# EAGLE design ThermostatAVT1742 (EAGLE 9.6.2)
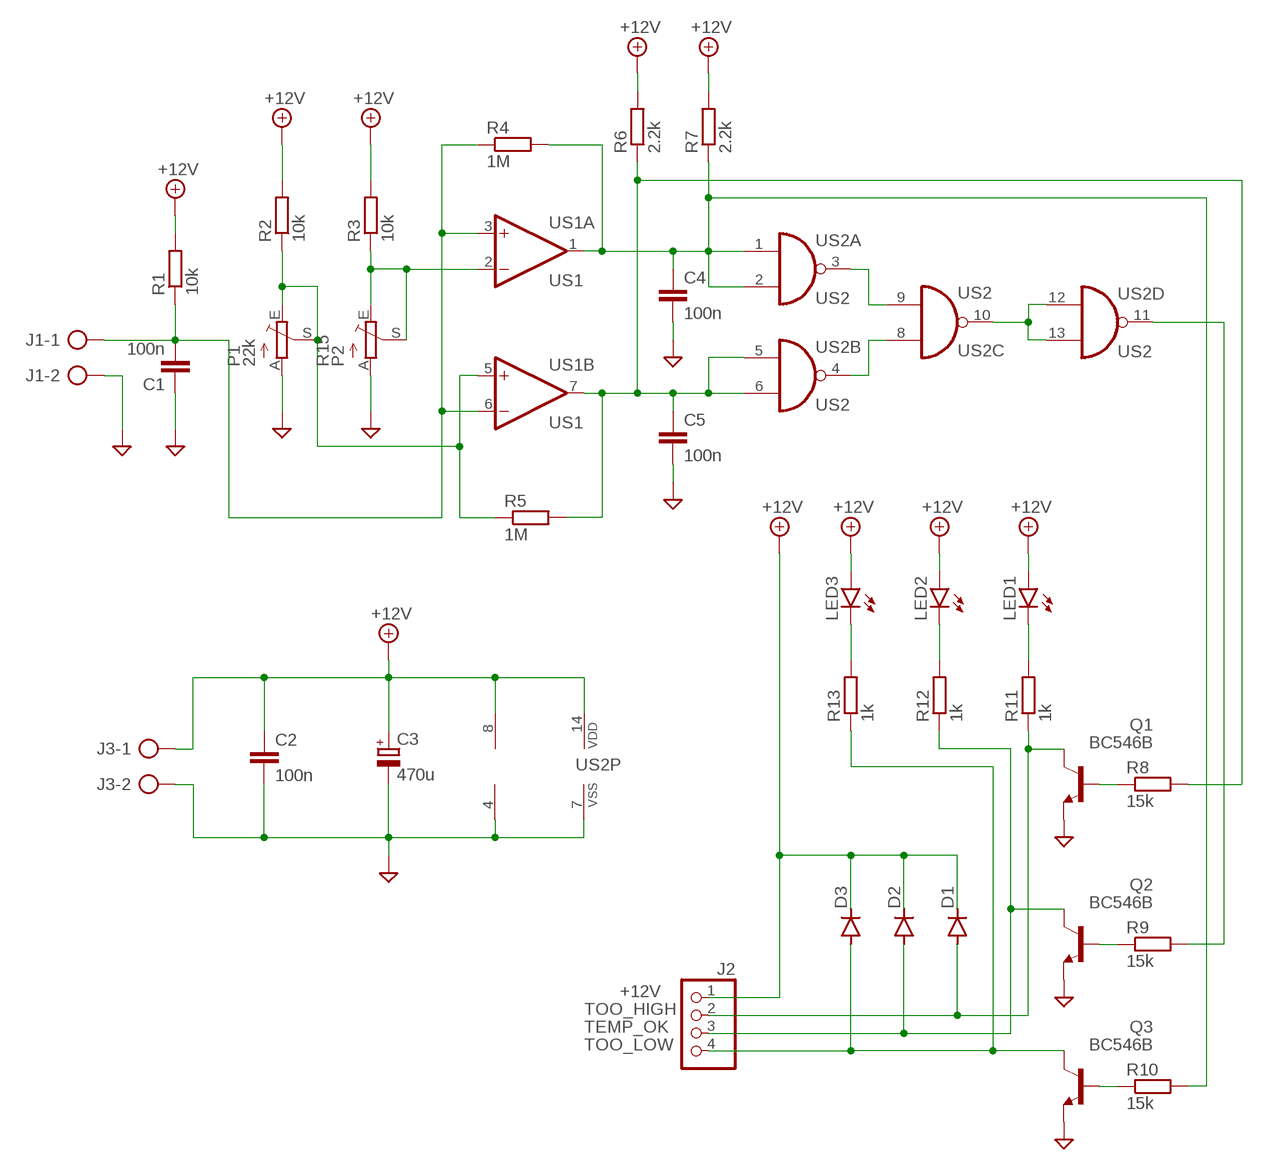
[diagram p0: schematic, sheet 1]

## Parts
C1  100n  C-EU050-025X075  [C050-025X075]
C2  100n  C-EU050-025X075  [C050-025X075]
C3  470u  CPOL-EUE3.5-8  [E3,5-8]
C4  100n  C-EU050-025X075  [C050-025X075]
C5  100n  C-EU050-025X075  [C050-025X075]
D1  red  1N4148DO35-10  [DO35-10]
D2  green  1N4148DO35-10  [DO35-10]
D3  yellow  1N4148DO35-10  [DO35-10]
J1  J1  AK500/2  [AK500/2]
J2  J2  PINHD-1X4  [1X04]
J3  J3  AK500/2  [AK500/2]
LED1  red  LED5MM  [LED5MM]
LED2  green  LED5MM  [LED5MM]
LED3  yellow  LED5MM  [LED5MM]
P1  22k  TRIM_EU-CA6V  [CA6V]
Q1  BC546B  [TO92-EBC]
Q2  BC546B  [TO92-EBC]
Q3  BC546B  [TO92-EBC]
R1  10k  R-EU_0207/10  [0207/10]
R2  10k  R-EU_0207/10  [0207/10]
R3  10k  R-EU_0207/10  [0207/10]
R4  1M  R-EU_0207/10  [0207/10]
R5  1M  R-EU_0207/10  [0207/10]
R6  2.2k  R-EU_0207/10  [0207/10]
R7  2.2k  R-EU_0207/10  [0207/10]
R8  15k  R-EU_0207/10  [0207/10]
R9  15k  R-EU_0207/10  [0207/10]
R10  15k  R-EU_0207/10  [0207/10]
R11  1k  R-EU_0207/10  [0207/10]
R12  1k  R-EU_0207/10  [0207/10]
R13  1k  R-EU_0207/10  [0207/10]
R15  P2  TRIM_EU-CA6V  [CA6V]
US1  US1  LM393N  [DIL08]
US2  US2  4011N  [DIL14]

## Nets
+12V: C2.1 C3.+ D1.C D2.C D3.C J2.1 J3.1 LED1.A LED2.A LED3.A R1.2 R2.2 R3.2 R6.2 R7.2 US1.8(P:V+) US2.14(P:VDD)
BASE_HIGH: Q1.B R8.1
BASE_LOW: Q3.B R10.1
BASE_OK: Q2.B R9.1
GND: C1.1 C2.2 C3.- C4.2 C5.2 J1.2 J3.2 P1.A Q1.E Q2.E Q3.E R15.A US1.4(P:V-) US2.7(P:VSS)
L_GREEN: LED2.K(C) R12.2
L_RED: LED1.K(C) R11.2
L_YELLOW: LED3.K(C) R13.2
NTC_SIGNAL: C1.2 J1.1 R1.1 R4.1 US1.3(A:+IN) US1.6(B:-IN)
OUT_HI_LOGIC: C4.1 R4.2 R7.1 R10.2 US1.1(A:OUT) US2.1(A:I0) US2.2(A:I1)
OUT_LO_LOGIC: C5.1 R5.2 R6.1 R8.2 US1.7(B:OUT) US2.5(B:I0) US2.6(B:I1)
PRESET_HIGH: R3.1 R15.E R15.S US1.2(A:-IN)
PRESET_LOW: P1.E P1.S R2.1 R5.1 US1.5(B:+IN)
SYGNAL_A: US2.3(A:O) US2.9(C:I1)
SYGNAL_B: US2.4(B:O) US2.8(C:I0)
TEMP_OK: D2.A J2.3 Q2.C R12.1
TEMP_OK_FINAL: R9.2 US2.11(D:O)
TEMP_OK_NEG: US2.10(C:O) US2.12(D:I0) US2.13(D:I1)
TOO_HIGH: D1.A J2.2 Q1.C R11.1
TOO_LOW: D3.A J2.4 Q3.C R13.1

## Library data of the parts
C1 C2 C4 C5 = rcl:C-EU: CAPACITOR, European symbol; SPICEPREFIX: C
C3 = rcl:CPOL-EU: POLARIZED CAPACITOR, European symbol; SPICEPREFIX: C
D1-D3 = diode:1N4148: DIODE high speed (Philips)
J1 J3 = con-ptr500:AK500/2: CONNECTOR; OC_FARNELL: unknown; OC_NEWARK: unknown
J2 = pinhead:PINHD-1X4: PIN HEADER
LED1-LED3 = led:LED: LED OSRAM: - CHIPLED LG R971, LG N971, LY N971, LG Q971, LY Q971, LO R971, LY R971 LH N974, LH R974 LS Q976, LO Q976, LY Q976 LO Q996 - Hyper CHIPLED LW Q18S LB Q993, LB Q99A, LB R99A - SideLED LS A670, LO A670, LY A670, LG A670, LP A670 LB A673, LV A673, LT A673, LW A673 LH A674 LY A675 LS A676, LA A676, LO A676, LY A676, LW A676 LS A679, LY A679, LG A679 - Hyper Micro SIDELED® LS Y876, LA Y876, LO Y876, LY Y876 LT Y87S - SmartLED LW L88C, LW L88S LB L89C, LB L89S, LG L890 LS L89K, LO L89K, LY L89K LS L896, LA L896, LO L896, LY L896 - TOPLED LS T670, LO T670, LY T670, LG T670, LP T670 LSG T670, LSP T670, LSY T670, LOP T670, LYG T670 LG T671, LOG T671, LSG T671 LB T673, LV T673, LT T673, LW T673 LH T674 LS T676, LA T676, LO T676, LY T676, LB T676, LH T676, LSB T676, LW T676 LB T67C, LV T67C, LT T67C, LS T67K, LO T67K, LY T67K, LW E67C LS E67B, LA E67B, LO E67B, LY E67B, LB E67C, LV E67C, LT E67C LW T67C LS T679, LY T679, LG T679 LS T770, LO T770, LY T770, LG T770, LP T770 LB T773, LV T773, LT T773, LW T773 LH T774 LS E675, LA E675, LY E675, LS T675 LS T776, LA T776, LO T776, LY T776, LB T776 LHGB T686 LT T68C, LB T68C - Hyper Mini TOPLED® LB M676 - Mini TOPLED Santana® LG M470 LS M47K, LO M47K, LY M47K Source: http://www.osram.convergy.de LUXEON: - LUMILED® LXK2-PW12-R00, LXK2-PW12-S00, LXK2-PW14-U00, LXK2-PW14-V00 LXK2-PM12-R00, LXK2-PM12-S00, LXK2-PM14-U00 LXK2-PE12-Q00, LXK2-PE12-R00, LXK2-PE12-S00, LXK2-PE14-T00, LXK2-PE14-U00 LXK2-PB12-K00, LXK2-PB12-L00, LXK2-PB12-M00, LXK2-PB14-N00, LXK2-PB14-P00, LXK2-PB14-Q00 LXK2-PR12-L00, LXK2-PR12-M00, LXK2-PR14-Q00, LXK2-PR14-R00 LXK2-PD12-Q00, LXK2-PD12-R00, LXK2-PD12-S00 LXK2-PH12-R00, LXK2-PH12-S00 LXK2-PL12-P00, LXK2-PL12-Q00, LXK2-PL12-R00 Source: www.luxeon.com KINGBRIGHT: KA-3528ASYC Source: www.kingbright.com
P1 R15 = pot:TRIM_EU-: POTENTIOMETER
Q1-Q3 = transistor-npn:BC546*: NPN Transistor
R1-R13 = rcl:R-EU_: RESISTOR, European symbol; SPICEPREFIX: R
US1 = linear:LM393: COMPARATOR
US2 = 40xx:4011: Quad 2-input NAND

## Board
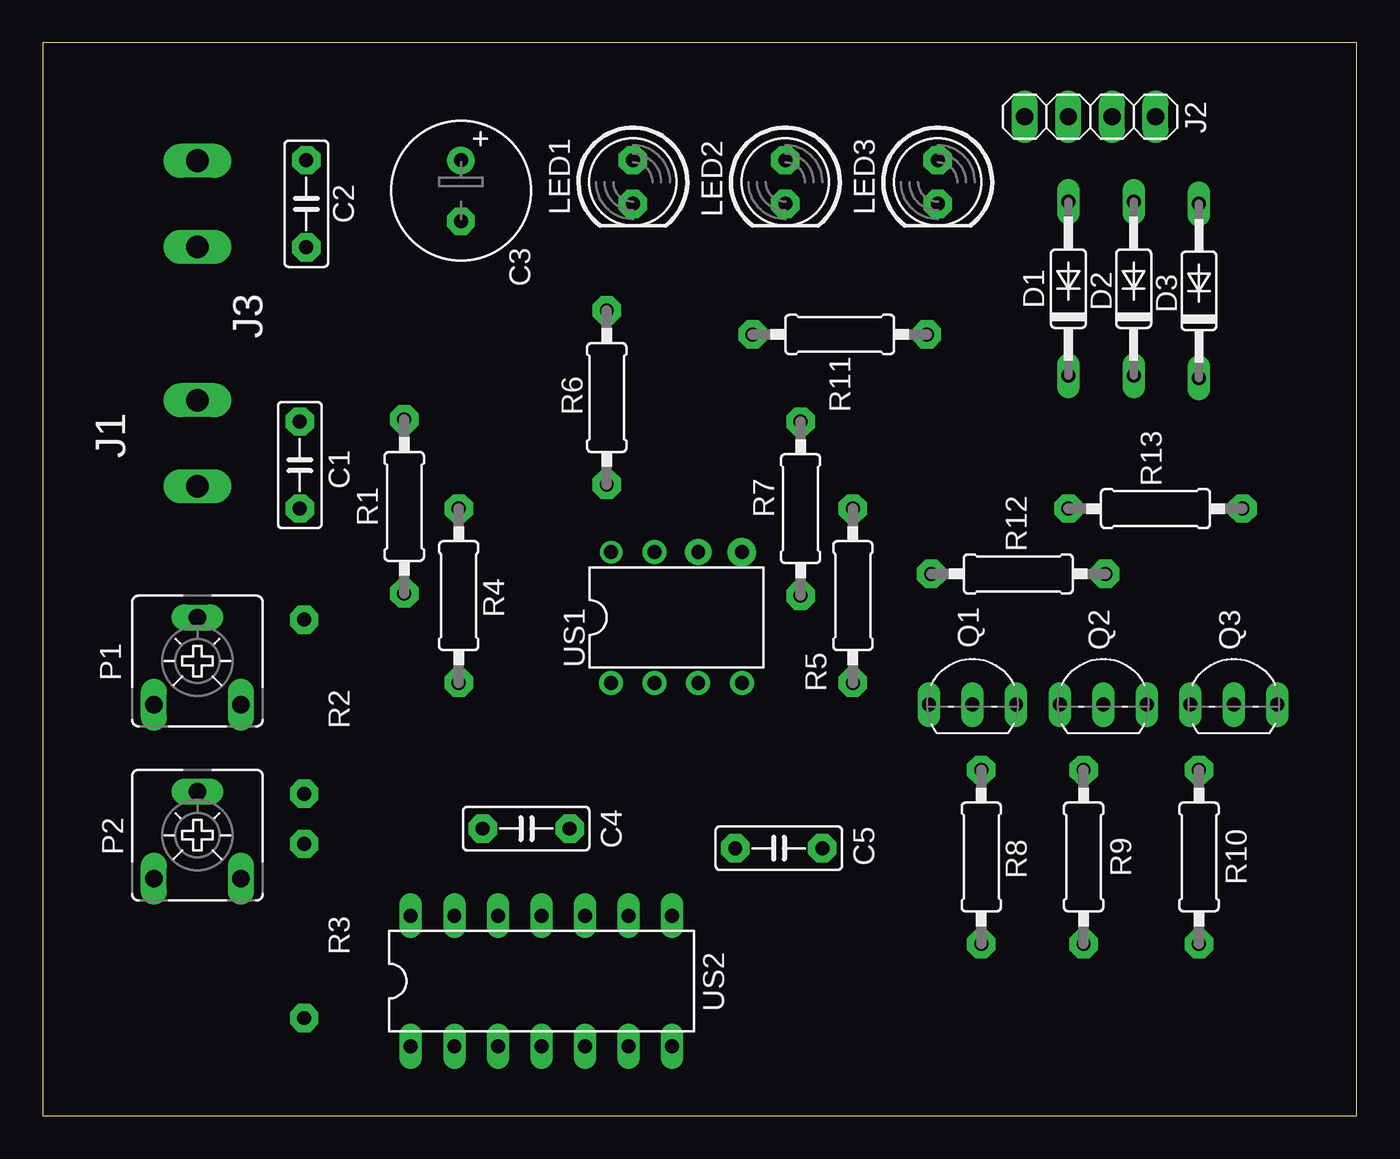
[diagram p1: board, top side]
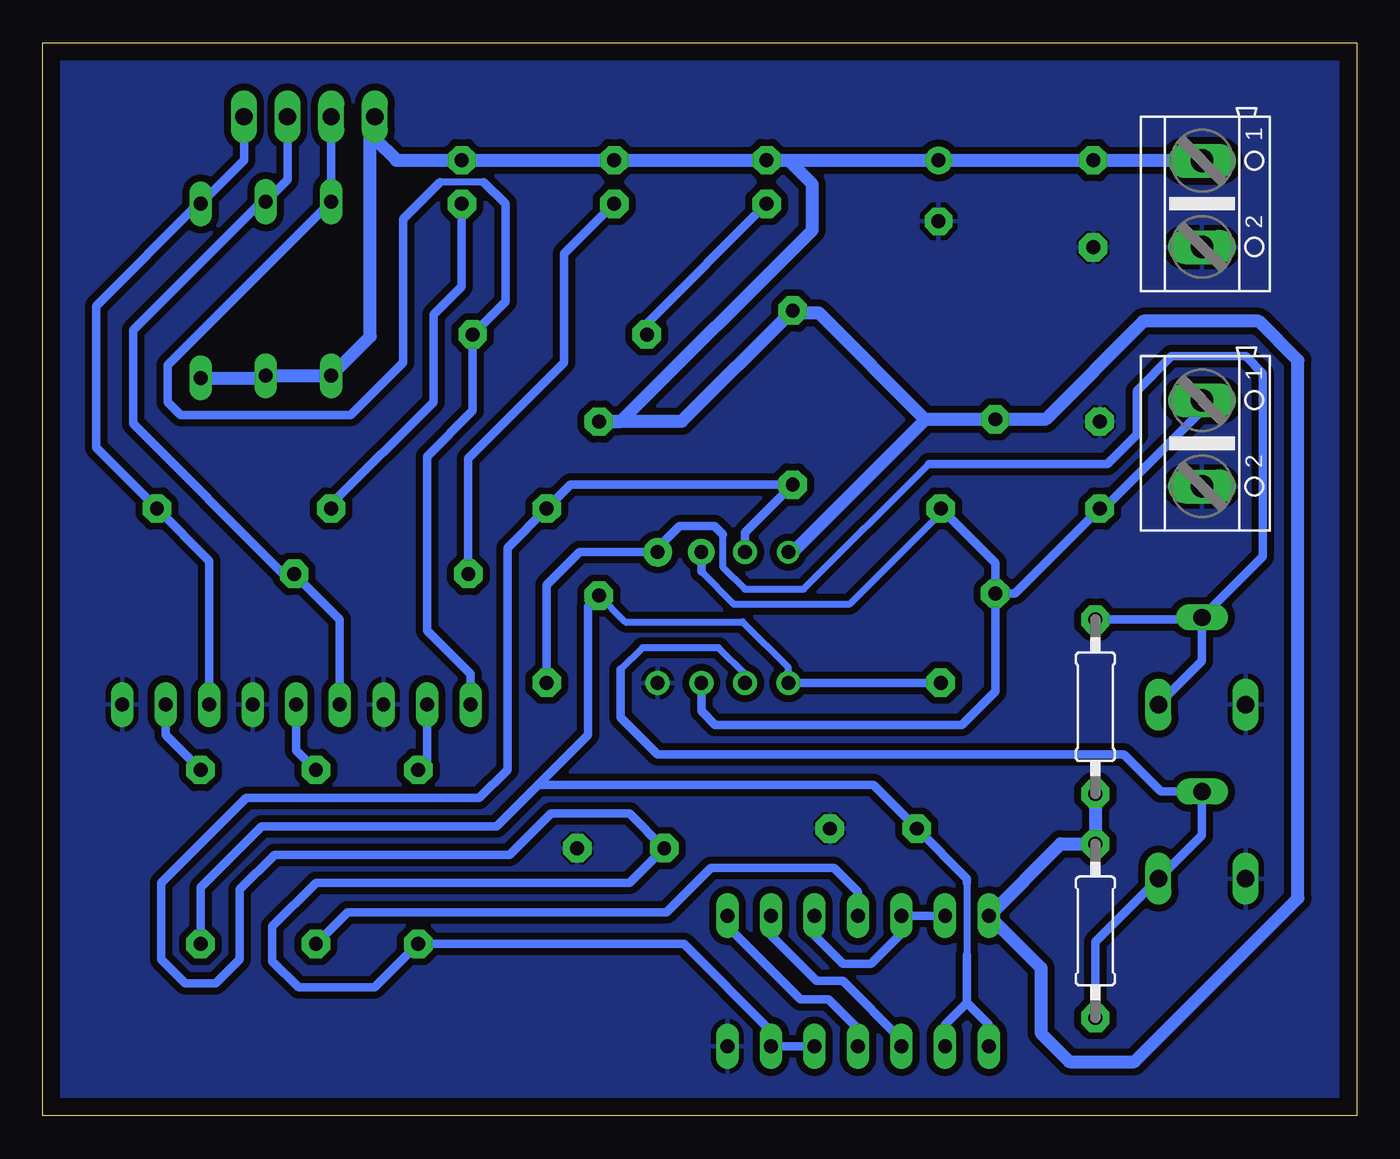
[diagram p2: board, bottom side, seen from below]

Size 76.63 x 62.6 mm. Coordinates in mm from the lower left corner, seen from the top.
Outline: 0,0 76.63,0 76.63,62.6 0,62.6 0,0
Copper layers (1*16): Top 0.035mm / dielectric 1.5mm / Bottom 0.035mm
Design rules "default *": minimum track width 16mil, minimum drill 0.35mm, track to track 12mil, track to pad 8mil, pad to pad 6mil, via to via 6mil, smd to smd 6mil, copper to edge 40mil, drill to drill 6mil, minimum pad ring 10mil, minimum via ring 8mil, stop-mask expansion 4mil, vias tented up to drill 0mil, thermal gap 12mil

### Footprints (pad centres in the part's own frame; a part is rotated, then mirrored left to right if it is on the bottom)
C050-025X075 = drill 0.813 octagon: 1 -2.54,0; 2 2.54,0
E3,5-8 = drill 0.813 pad 1.6: + -1.778,0 | drill 0.813 pad 1.6 octagon: - 1.778,0
DO35-10 = drill 0.813 long: A 5.08,0; C -5.08,0
AK500/2 = drill 1.321 long: 1 -2.515,0; 2 2.515,0
1X04 = drill 1.016 long: 1 -3.81,0; 2 -1.27,0; 3 1.27,0; 4 3.81,0
LED5MM = drill 0.813 octagon: A -1.27,0; K 1.27,0
CA6V = drill 1.016 long: A -2.54,-2.54; E 2.54,-2.54; S 0,2.54
TO92-EBC = drill 0.813 long: B 0,-1.27; C -2.54,-1.27; E 2.54,-1.27
0207/10 = drill 0.813 octagon: 1 -5.08,0; 2 5.08,0
DIL08 = drill 0.813 pad 1.27: 1 -3.81,-3.81; 2 -1.27,-3.81; 3 1.27,-3.81; 4 3.81,-3.81; 5 3.81,3.81; 6 1.27,3.81; 7 -1.27,3.81; 8 -3.81,3.81
DIL14 = drill 0.813 long: 1 -7.62,-3.81; 2 -5.08,-3.81; 3 -2.54,-3.81; 4 0,-3.81; 5 2.54,-3.81; 6 5.08,-3.81; 7 7.62,-3.81; 8 7.62,3.81; 9 5.08,3.81; 10 2.54,3.81; 11 0,3.81; 12 -2.54,3.81; 13 -5.08,3.81; 14 -7.62,3.81

### Placement (x,y rotation side)
C1  14.99,37.97 270 top
C2  15.37,53.21 270 top
C3  24.38,53.98 270 top
C4  28.19,16.76 0 top
C5  42.93,15.62 0 top
D1  59.82,48.26 90 top
D2  63.63,48.26 90 top
D3  67.44,48.13 90 top
J1  9.02,39.24 270 bottom
J2  61.09,58.29 0 top
J3  9.02,53.21 270 bottom
LED1  34.42,54.48 270 top
LED2  43.31,54.48 270 top
LED3  52.2,54.48 270 top
P1  9.02,26.54 0 top
Q1  54.23,25.27 0 top
Q2  61.85,25.27 0 top
Q3  69.47,25.27 0 top
R1  21.08,35.56 90 top
R2  15.24,23.88 270 bottom
R3  15.24,10.79 90 bottom
R4  24.26,30.35 270 top
R5  47.24,30.35 90 top
R6  32.89,41.91 90 top
R7  44.2,35.43 90 top
R8  54.74,15.11 270 top
R9  60.71,15.11 270 top
R10  67.44,15.11 270 top
R11  46.48,45.59 180 top
R12  56.9,31.62 180 top
R13  64.9,35.43 180 top
R15  9.02,16.38 0 top
US1  36.96,29.08 0 top
US2  29.08,7.87 0 top

### Tracks (layer width: path | path; a pad name or v marks a point on that pad's centre or on a via)
+12V  (via drill 0.76 pad 1.27, 0.81 pad 1.65)
  Bottom 0.762: J3.1 9.04,55.75 C2.1 C3.+ 33.15,55.75 | 57.28,57.02 J2.1 | D3.C 63.75,43.05 D2.C D1.C 57.53,45.47 57.53,57.28 57.28,57.02 | 57.28,57.02 56.01,55.75 LED3.A LED2.A LED1.A 33.15,55.75 | 33.15,55.75 31.75,54.36 31.75,51.69 42.93,40.51 R7.2 39.37,40.51 R6.2 32.77,46.86 31.37,46.86 25.15,40.64 | 25.15,40.64 32.89,32.89 US1.8 | 25.15,40.64 R1.2 18.16,40.64 12.45,46.35 5.71,46.35 3.43,44.07 3.43,12.7 12.95,3.17 16.76,3.17 18.41,4.83 18.41,8.64 US2.14 17.27,15.88 R3.2 R2.2
  other vias: 15.24,18.8 21.08,40.64 15.24,15.88 32.89,46.99 44.2,40.51 34.42,55.75 43.31,55.75 52.2,55.75 15.37,55.75 33.15,32.89
BASE_HIGH  (via drill 0.81 pad 1.65)
  Bottom 0.508: Q1.B 54.23,20.7 R8.1
  other vias: 54.74,20.19
BASE_LOW  (via drill 0.81 pad 1.65)
  Bottom 0.508: R10.1 69.47,22.23 Q3.B
  other vias: 67.44,20.19
BASE_OK  (via drill 0.81 pad 1.65)
  Bottom 0.508: Q2.B 61.85,21.34 R9.1
  other vias: 60.71,20.19
GND  (via drill 0.76 pad 1.4, 0.81 pad 1.65)
  other vias: 40.77,25.27 15.37,50.67 30.73,16.76 45.47,15.62 14.99,40.51
  pour Bottom (isolate 0.406): 0,62.61 0,0 76.71,0 76.71,62.61
L_GREEN  (via drill 0.81 pad 1.65)
  Bottom 0.508: LED2.K 46.23,50.29 46.23,43.94 51.82,38.35 R12.2
  other vias: 51.82,31.62 43.31,53.21
L_RED  (via drill 0.81 pad 1.65)
  Bottom 0.508: R11.2 41.4,46.23 LED1.K
  other vias: 41.4,45.59 34.42,53.21
L_YELLOW  (via drill 0.81 pad 1.65)
  Bottom 0.508: LED3.K 52.2,48.39 53.85,46.74 53.85,41.66 59.82,35.69 R13.2
  other vias: 59.82,35.43 52.2,53.21
NTC_SIGNAL  (via drill 0.76 pad 1.4, 0.76 pad 1.52, 0.81 pad 1.65)
  Bottom 0.406: 38.23,31.75 36.32,29.84 29.59,29.84 24.26,35.18
  Bottom 0.508: J1.1 9.02,41.15 14.73,35.43 C1.2 19.94,30.48 R1.1 | 24.26,35.18 R4.1 21.08,32.26 R1.1 | US1.6 38.23,31.75 | R1.1 21.08,24.77 23.04,22.81 37.41,22.81 38.23,23.62 US1.3
  other vias: 24.26,35.43 21.08,30.48 38.23,32.89 38.23,25.27 14.99,35.43
OUT_HI_LOGIC  (via drill 0.76 pad 1.4, 0.81 pad 1.65)
  Bottom 0.406: 22.73,13.59 22.73,9.4 | US1.1 33.15,26.16 35.81,28.83 42.67,28.83 R7.1
  Bottom 0.508: US1.1 R4.2 | 47.75,19.3 50.16,16.89 63.88,16.89 67.44,13.33 R10.2 | 47.75,19.3 28.19,19.3 C4.1 22.73,13.84 22.73,13.59 | 22.73,6.6 21.46,5.33 US2.1 | 22.73,6.6 22.73,9.4 | US2.2 24,5.33 22.73,6.6 | R7.1 44.83,29.72 44.83,22.23 47.75,19.3
  other vias: 24.26,25.27 44.2,30.35 67.44,10.03 33.15,25.27 25.65,16.76
OUT_LO_LOGIC  (via drill 0.76 pad 1.4, 0.81 pad 1.65)
  Bottom 0.508: US1.7 35.69,34.04 R6.1 45.85,36.83 R5.2 49.53,33.15 49.53,20.19 51.18,18.54 64.77,18.54 69.72,13.59 69.72,9.14 68.33,7.75 66.55,7.75 65.15,9.14 65.15,13.21 63.12,15.24 49.4,15.24 46.99,17.65 42.42,17.65 C5.1 42.42,13.59 60.71,13.59 63.25,11.05 63.25,9.02 61.72,7.49 57.28,7.49 R8.2 39.24,10.03 34.16,4.95 US2.6 US2.5
  other vias: 54.74,10.03 32.89,36.83 47.24,35.43 35.69,32.89 40.39,15.62
PRESET_HIGH  (via drill 0.76 pad 1.4, 0.81 pad 1.65)
  Bottom 0.406: 35.69,25.78 37.21,27.3 41.66,27.3 42.93,26.04
  Bottom 0.508: R3.1 15.24,10.16 R15.E 9.02,16.38 R15.S 11.43,18.92 13.59,21.08 40.77,21.08 42.93,23.24 42.93,26.04 | 35.69,25.78 US1.2
  other vias: 15.24,5.71 35.69,25.27
PRESET_LOW  (via drill 0.76 pad 1.65, 0.81 pad 1.65)
  Bottom 0.406: 36.96,33.91 36.96,32 35.69,30.73 32.26,30.73 24.95,38.04
  Bottom 0.508: R5.1 47.24,30.99 45.34,32.89 US1.5 40.77,33.15 39.5,34.42 37.47,34.42 36.96,33.91 | 24.95,38.04 14.54,38.04 12.83,39.75 12.83,42.29 10.79,44.32 6.48,44.32 5.46,43.31 5.46,32.64 P1.S | P1.E 9.02,26.54 P1.S | P1.S 9.14,28.96 R2.1
  other vias: 15.24,28.96 47.24,25.27 40.77,32.89
SYGNAL_A
  Bottom 0.508: US2.9 34.16,10.54 31.5,7.87 29.97,7.87 26.54,4.45 US2.3
SYGNAL_B
  Bottom 0.508: US2.8 36.7,11.05 32.45,6.79 30.8,6.79 29.08,5.08 US2.4
TEMP_OK  (via drill 0.81 pad 1.65)
  Bottom 0.508: Q2.C 59.31,28.96 R12.1 62.61,31.62 71.37,40.39 71.37,45.85 63.88,53.34 D2.A 62.36,54.61 J2.3
  other vias: 61.98,31.62
TEMP_OK_FINAL  (via drill 0.81 pad 1.65)
  Bottom 0.508: R9.2 58.85,11.89 40.26,11.89 37.67,14.48 30.48,14.48 29.08,13.08 US2.11
  other vias: 60.71,10.03
TEMP_OK_NEG
  Bottom 0.508: US2.13 US2.12 26.54,10.67 28.32,8.89 29.97,8.89 31.62,10.54 US2.10
TOO_HIGH  (via drill 0.81 pad 1.65)
  Bottom 0.406: 50.93,54.48 53.47,54.48
  Bottom 0.508: 50.93,54.48 49.66,53.21 49.66,47.5 v51.56,45.59 51.56,41.15 54.23,38.48 54.23,28.32 51.69,25.78 Q1.C | 53.47,54.48 55.63,52.32 55.63,43.94 58.67,40.89 68.58,40.89 69.34,41.66 69.34,43.81 D1.A J2.2
TOO_LOW  (via drill 0.81 pad 1.65)
  Bottom 0.508: J2.4 64.9,55.75 D3.A 67.56,53.21 73.53,47.24 73.53,38.99 R13.1 66.93,32.38 Q3.C
  other vias: 69.98,35.43